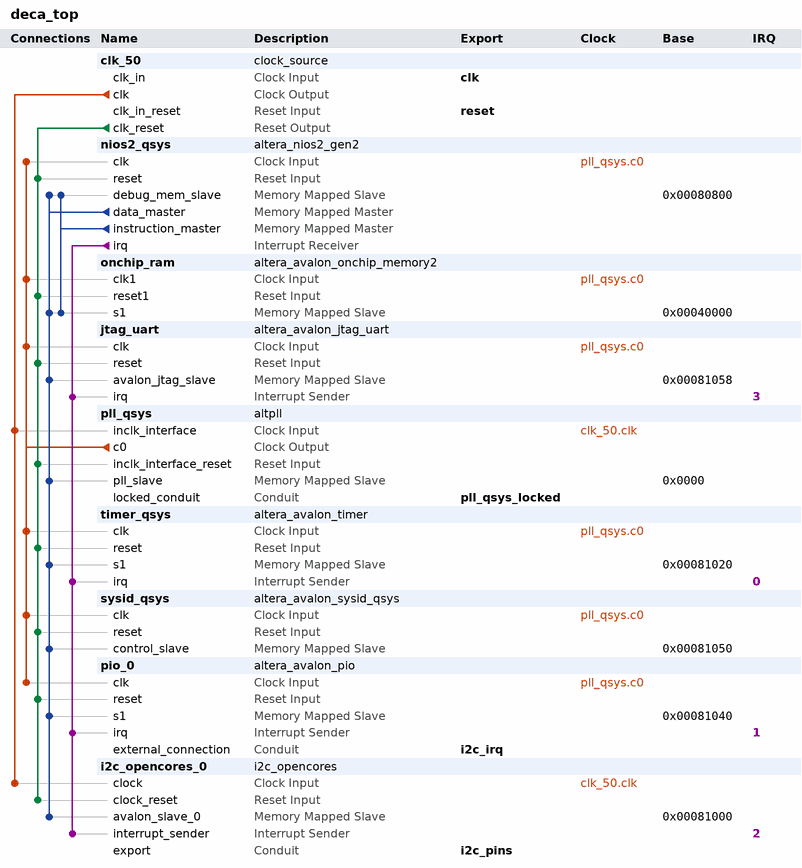
[diagram p0: system contents]
# Platform Designer (Qsys) system deca_top, MAX 10 10M50DAF484C6GES
# Parameters at their usual value, and those the tool derives, are not listed.
package require -exact qsys 15.0
create_system deca_top
set_project_property DEVICE_FAMILY {MAX 10}
set_project_property DEVICE 10M50DAF484C6GES

add_instance clk_50 clock_source 15.0
set_instance_parameter_value clk_50 clockFrequency 50000000

add_instance nios2_qsys altera_nios2_gen2 15.0
set_instance_parameter_value nios2_qsys dcache_size 2048
set_instance_parameter_value nios2_qsys exceptionSlave onchip_ram.s1
set_instance_parameter_value nios2_qsys icache_size 4096
set_instance_parameter_value nios2_qsys impl Fast
set_instance_parameter_value nios2_qsys resetSlave onchip_ram.s1

add_instance onchip_ram altera_avalon_onchip_memory2 15.0
set_instance_parameter_value onchip_ram dataWidth 32
set_instance_parameter_value onchip_ram dualPort false
set_instance_parameter_value onchip_ram initMemContent true
set_instance_parameter_value onchip_ram initializationFileName onchip_mem.hex
set_instance_parameter_value onchip_ram memorySize 156864

add_instance jtag_uart altera_avalon_jtag_uart 15.0
set_instance_parameter_value jtag_uart simInteractiveOptions NO_INTERACTIVE_WINDOWS

add_instance pll_qsys altpll 15.0
set_instance_parameter_value pll_qsys CLK0_DIVIDE_BY 1
set_instance_parameter_value pll_qsys CLK0_MULTIPLY_BY 2
set_instance_parameter_value pll_qsys INCLK0_INPUT_FREQUENCY 20000
set_instance_parameter_value pll_qsys PORT_ARESET PORT_UNUSED
set_instance_parameter_value pll_qsys PORT_LOCKED PORT_USED
set_instance_parameter_value pll_qsys PORT_clk1 PORT_UNUSED
set_instance_parameter_value pll_qsys PORT_clk2 PORT_UNUSED
set_instance_parameter_value pll_qsys PORT_clk3 PORT_UNUSED

add_instance timer_qsys altera_avalon_timer 15.0
set_instance_parameter_value timer_qsys period 1
set_instance_parameter_value timer_qsys periodUnits MSEC

add_instance sysid_qsys altera_avalon_sysid_qsys 15.0
set_instance_parameter_value sysid_qsys id 0

add_instance pio_0 altera_avalon_pio 15.0
set_instance_parameter_value pio_0 captureEdge true
set_instance_parameter_value pio_0 direction Input
set_instance_parameter_value pio_0 generateIRQ true
set_instance_parameter_value pio_0 irqType EDGE
set_instance_parameter_value pio_0 width 1

add_instance i2c_opencores_0 i2c_opencores 13.0

# connections
add_connection clk_50.clk i2c_opencores_0.clock clock
add_connection clk_50.clk pll_qsys.inclk_interface clock
add_connection pll_qsys.c0 jtag_uart.clk clock
add_connection pll_qsys.c0 nios2_qsys.clk clock
add_connection pll_qsys.c0 onchip_ram.clk1 clock
add_connection pll_qsys.c0 pio_0.clk clock
add_connection pll_qsys.c0 sysid_qsys.clk clock
add_connection pll_qsys.c0 timer_qsys.clk clock
add_connection clk_50.clk_reset i2c_opencores_0.clock_reset reset
add_connection clk_50.clk_reset jtag_uart.reset reset
add_connection clk_50.clk_reset nios2_qsys.reset reset
add_connection clk_50.clk_reset onchip_ram.reset1 reset
add_connection clk_50.clk_reset pio_0.reset reset
add_connection clk_50.clk_reset pll_qsys.inclk_interface_reset reset
add_connection clk_50.clk_reset sysid_qsys.reset reset
add_connection clk_50.clk_reset timer_qsys.reset reset
add_connection nios2_qsys.data_master i2c_opencores_0.avalon_slave_0 avalon
set_connection_parameter_value nios2_qsys.data_master/i2c_opencores_0.avalon_slave_0 baseAddress 0x00081000
add_connection nios2_qsys.data_master jtag_uart.avalon_jtag_slave avalon
set_connection_parameter_value nios2_qsys.data_master/jtag_uart.avalon_jtag_slave baseAddress 0x00081058
add_connection nios2_qsys.data_master nios2_qsys.debug_mem_slave avalon
set_connection_parameter_value nios2_qsys.data_master/nios2_qsys.debug_mem_slave baseAddress 0x00080800
add_connection nios2_qsys.data_master onchip_ram.s1 avalon
set_connection_parameter_value nios2_qsys.data_master/onchip_ram.s1 baseAddress 0x00040000
add_connection nios2_qsys.data_master pio_0.s1 avalon
set_connection_parameter_value nios2_qsys.data_master/pio_0.s1 baseAddress 0x00081040
add_connection nios2_qsys.data_master pll_qsys.pll_slave avalon
set_connection_parameter_value nios2_qsys.data_master/pll_qsys.pll_slave baseAddress 0x0000
add_connection nios2_qsys.data_master sysid_qsys.control_slave avalon
set_connection_parameter_value nios2_qsys.data_master/sysid_qsys.control_slave baseAddress 0x00081050
add_connection nios2_qsys.data_master timer_qsys.s1 avalon
set_connection_parameter_value nios2_qsys.data_master/timer_qsys.s1 baseAddress 0x00081020
add_connection nios2_qsys.instruction_master nios2_qsys.debug_mem_slave avalon
set_connection_parameter_value nios2_qsys.instruction_master/nios2_qsys.debug_mem_slave baseAddress 0x00080800
add_connection nios2_qsys.instruction_master onchip_ram.s1 avalon
set_connection_parameter_value nios2_qsys.instruction_master/onchip_ram.s1 baseAddress 0x00040000
add_connection nios2_qsys.irq i2c_opencores_0.interrupt_sender interrupt
set_connection_parameter_value nios2_qsys.irq/i2c_opencores_0.interrupt_sender irqNumber 2
add_connection nios2_qsys.irq jtag_uart.irq interrupt
set_connection_parameter_value nios2_qsys.irq/jtag_uart.irq irqNumber 3
add_connection nios2_qsys.irq pio_0.irq interrupt
set_connection_parameter_value nios2_qsys.irq/pio_0.irq irqNumber 1
add_connection nios2_qsys.irq timer_qsys.irq interrupt
set_connection_parameter_value nios2_qsys.irq/timer_qsys.irq irqNumber 0

# exported interfaces
add_interface clk clock sink
set_interface_property clk EXPORT_OF clk_50.clk_in
add_interface i2c_irq conduit end
set_interface_property i2c_irq EXPORT_OF pio_0.external_connection
add_interface i2c_pins conduit end
set_interface_property i2c_pins EXPORT_OF i2c_opencores_0.export
add_interface pll_qsys_locked conduit end
set_interface_property pll_qsys_locked EXPORT_OF pll_qsys.locked_conduit
add_interface reset reset sink
set_interface_property reset EXPORT_OF clk_50.clk_in_reset

set_interconnect_requirement {$system} qsys_mm.clockCrossingAdapter HANDSHAKE
set_interconnect_requirement {$system} qsys_mm.enableEccProtection FALSE
set_interconnect_requirement {$system} qsys_mm.insertDefaultSlave FALSE
set_interconnect_requirement {$system} qsys_mm.maxAdditionalLatency 1

save_system deca_top.qsys
